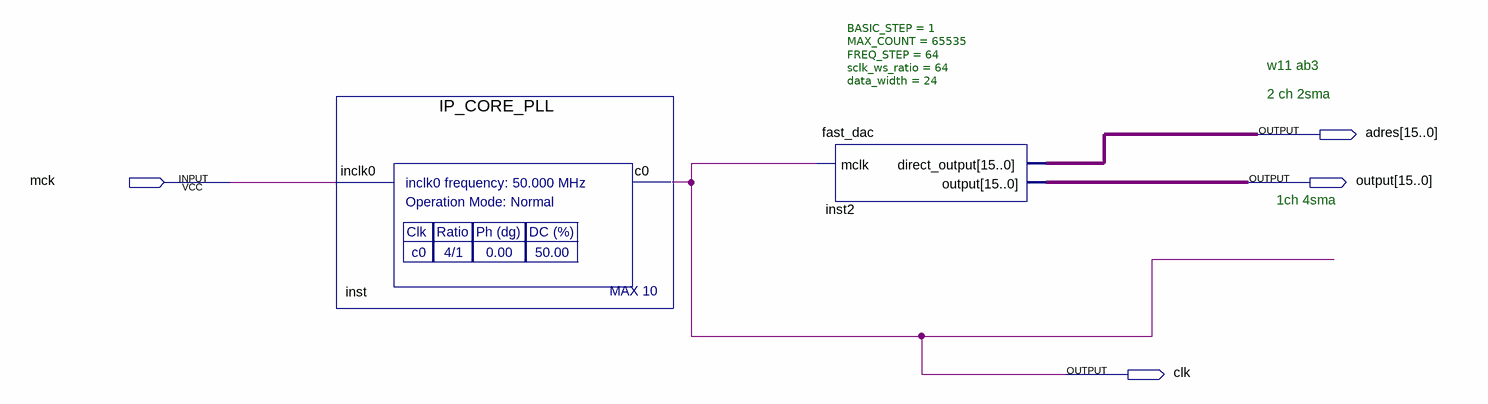
[diagram p0: schematic sheet]
// Quartus schematic Main_structure.bdf as structural Verilog: 2 symbols, 4 pins
module Main_structure (
  input  mck,
  output [15:0] adres,
  output [15:0] \output ,
  output clk
);

  IP_CORE_PLL inst (.inclk0(mck), .c0(clk));
  fast_dac #(.BASIC_STEP(1), .MAX_COUNT(65535), .FREQ_STEP(64), .sclk_ws_ratio(64), .data_width(24)) inst2 (
    .mclk(clk), .direct_output(adres), .\output (\output ));

  // Notes on the sheet:
  //   w11 ab3
  //   2 ch 2sma
  //   1ch 4sma
endmodule
